# Altium project RD15002_SingleSCT.PrjPcb
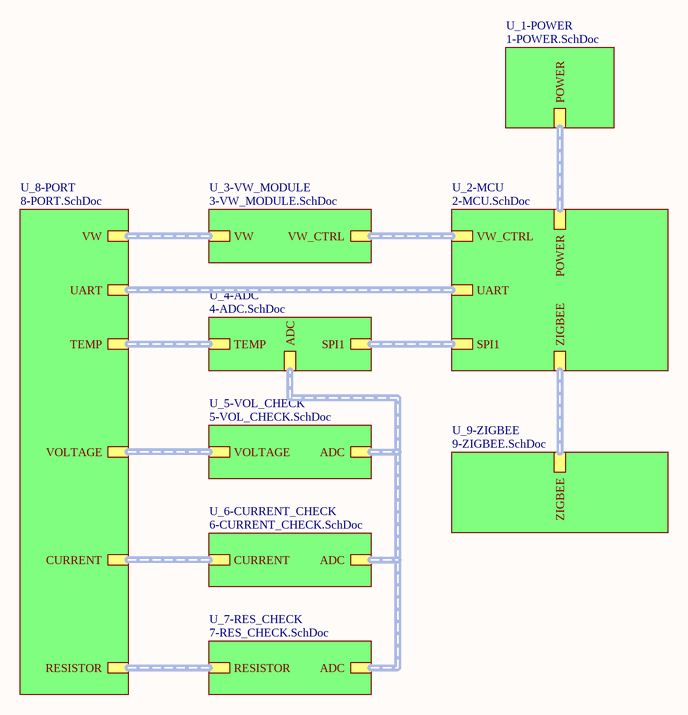
[diagram p0: RD15002_SingleSCT.SchDoc]
10 sheets, 207 parts. Net scope: hierarchical (ports join the sheet entries above them; power ports are global).
Board files: RD15002_SingleSCT.PcbDoc, RD15002_SingleSCT-20151223.PcbDoc
Sheets:
  RD15002_SingleSCT.SchDoc
    U_1-POWER = 1-POWER.SchDoc
    U_2-MCU = 2-MCU.SchDoc
    U_3-VW_MODULE = 3-VW_MODULE.SchDoc
    U_4-ADC = 4-ADC.SchDoc
    U_5-VOL_CHECK = 5-VOL_CHECK.SchDoc
    U_6-CURRENT_CHECK = 6-CURRENT_CHECK.SchDoc
    U_7-RES_CHECK = 7-RES_CHECK.SchDoc
    U_8-PORT = 8-PORT.SchDoc
    U_9-ZIGBEE = 9-ZIGBEE.SchDoc

## Sheet RD15002_SingleSCT.SchDoc: RD15002_SingleSCT.PrjPcb
size A4; DrawnBy: 邓勇杰; Revision: A1.0.0; SheetNumber: 1; SheetTotal: 10; Time: 2015/12/2

### Sub-sheets
U_1-POWER = 1-POWER.SchDoc: POWER (harness POWER)
U_2-MCU = 2-MCU.SchDoc: UART (harness UART), ZIGBEE (harness ZIGBEE), POWER (harness POWER), SPI1 (harness SPI1), VW_CTRL (harness VW_CTRL)
U_3-VW_MODULE = 3-VW_MODULE.SchDoc: VW_CTRL (harness VW_CTRL), VW (harness VW)
U_4-ADC = 4-ADC.SchDoc: SPI1 (harness SPI1), TEMP (harness TEMP), ADC (harness ADC)
U_5-VOL_CHECK = 5-VOL_CHECK.SchDoc: VOLTAGE (harness VOLTAGE), ADC (harness ADC)
U_6-CURRENT_CHECK = 6-CURRENT_CHECK.SchDoc: CURRENT (harness CURRENT), ADC (harness ADC)
U_7-RES_CHECK = 7-RES_CHECK.SchDoc: RESISTOR (harness RESISTOR), ADC (harness ADC)
U_8-PORT = 8-PORT.SchDoc: UART (harness UART), VW (harness VW), TEMP (harness TEMP), VOLTAGE (harness VOLTAGE), CURRENT (harness CURRENT), RESISTOR (harness RESISTOR)
U_9-ZIGBEE = 9-ZIGBEE.SchDoc: ZIGBEE (harness ZIGBEE)

### Buses and harness runs
harness sheet U_1-POWER/POWER = sheet U_2-MCU/POWER
harness sheet U_2-MCU/SPI1 = sheet U_4-ADC/SPI1
harness sheet U_2-MCU/UART = sheet U_8-PORT/UART
harness sheet U_2-MCU/VW_CTRL = sheet U_3-VW_MODULE/VW_CTRL
harness sheet U_2-MCU/ZIGBEE = sheet U_9-ZIGBEE/ZIGBEE
harness sheet U_3-VW_MODULE/VW = sheet U_8-PORT/VW
harness sheet U_4-ADC/ADC = sheet U_5-VOL_CHECK/ADC = sheet U_6-CURRENT_CHECK/ADC = sheet U_7-RES_CHECK/ADC
harness sheet U_4-ADC/TEMP = sheet U_8-PORT/TEMP
harness sheet U_5-VOL_CHECK/VOLTAGE = sheet U_8-PORT/VOLTAGE
harness sheet U_6-CURRENT_CHECK/CURRENT = sheet U_8-PORT/CURRENT
harness sheet U_7-RES_CHECK/RESISTOR = sheet U_8-PORT/RESISTOR

### Notes on the sheet
- 文件版本:
- 原理图名:
- 工 程  名:
- 绘       制:
- 审       核:
- 第   页，共    页
- 日       期:

## Sheet 1-POWER.SchDoc: RD15002_SingleSCT.PrjPcb
size A4; DrawnBy: 邓勇杰; Revision: A1.0.0; SheetNumber: 2; SheetTotal: 10; Time: 2015/12/2
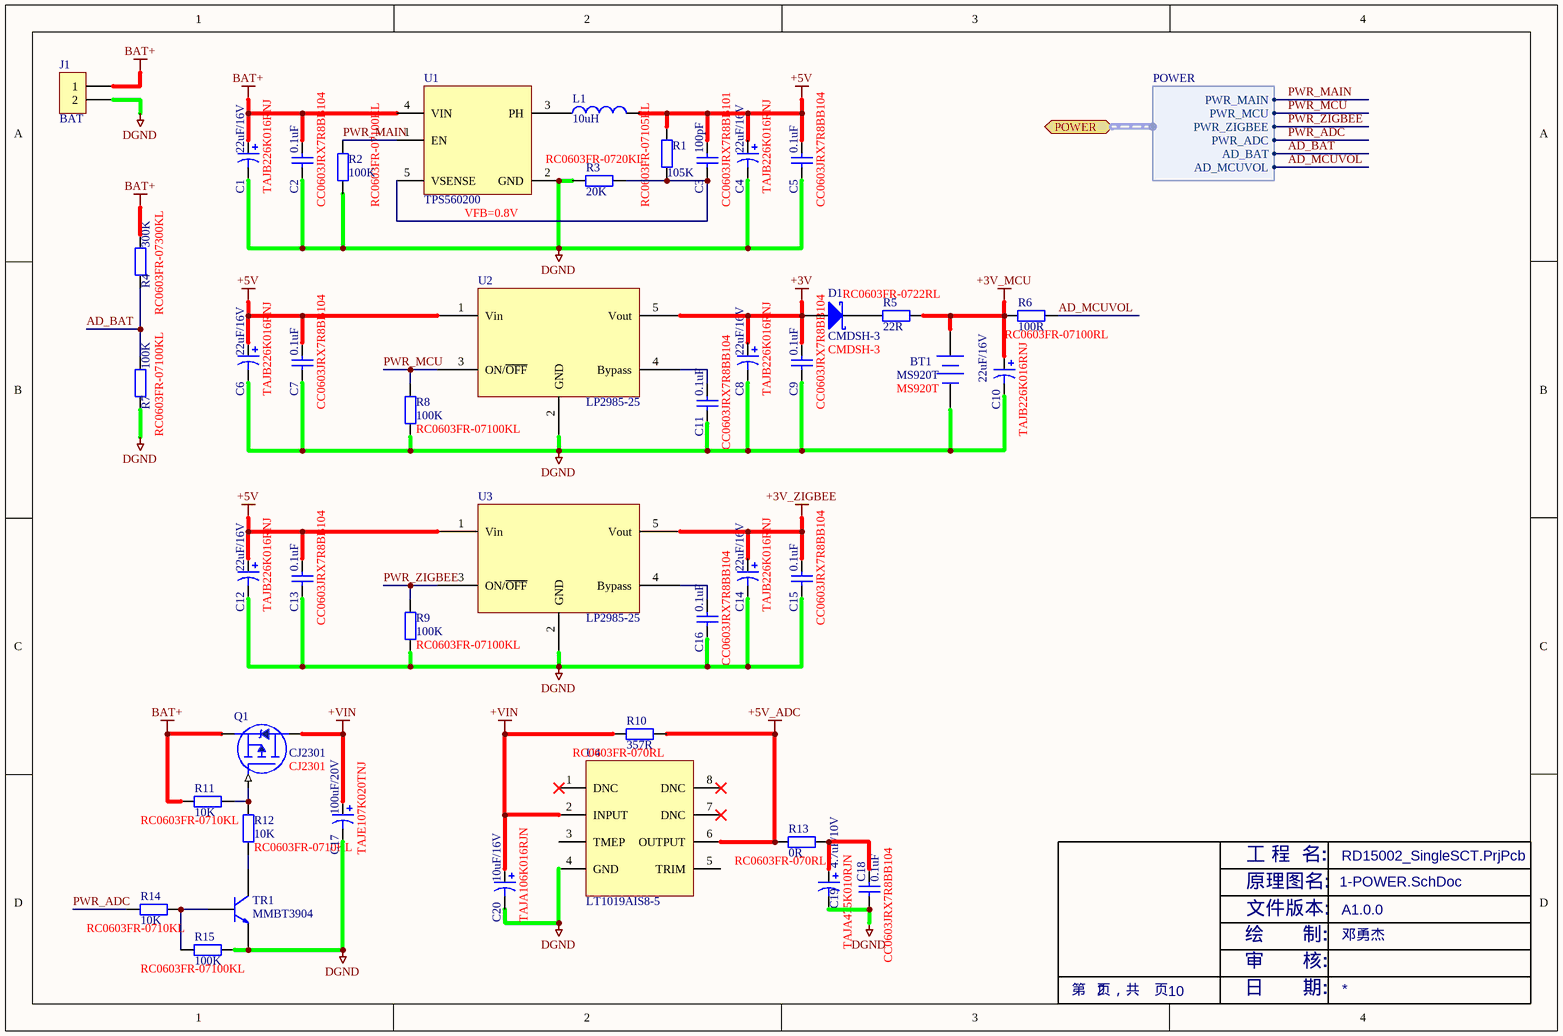
[diagram p1: 1-POWER.SchDoc]

### Parts
BT1  MS920T  [MS920T]
C1  22uF/16V  Part No.: TAJB226K016RNJ  [CB3528]
C2  0.1uF  Type No.: CC0603JRX7R8BB104  [CC0603]
C3  100pF  Type No.: CC0603JRX7R8BB101  [CC0603]
C4  22uF/16V  Part No.: TAJB226K016RNJ  [CB3528]
C5  0.1uF  Type No.: CC0603JRX7R8BB104  [CC0603]
C6  22uF/16V  Part No.: TAJB226K016RNJ  [CB3528]
C7  0.1uF  Type No.: CC0603JRX7R8BB104  [CC0603]
C8  22uF/16V  Part No.: TAJB226K016RNJ  [CB3528]
C9  0.1uF  Type No.: CC0603JRX7R8BB104  [CC0603]
C10  22uF/16V  Part No.: TAJB226K016RNJ  [CB3528]
C11  0.1uF  Type No.: CC0603JRX7R8BB104  [CC0603]
C12  22uF/16V  Part No.: TAJB226K016RNJ  [CB3528]
C13  0.1uF  Type No.: CC0603JRX7R8BB104  [CC0603]
C14  22uF/16V  Part No.: TAJB226K016RNJ  [CB3528]
C15  0.1uF  Type No.: CC0603JRX7R8BB104  [CC0603]
C16  0.1uF  Type No.: CC0603JRX7R8BB104  [CC0603]
C17  100uF/20V  Type No.: TAJE107K020TNJ  [CD7343]
C18  0.1uF  Type No.: CC0603JRX7R8BB104  [CC0603]
C19  4.7uF/10V  Type No.: TAJA475K010RJN  [CA3216]
C20  10uF/16V  Type No.: TAJA106K016RJN  [CA3216]
D1  CMDSH-3  [SOD323]
J1  BAT  [CON2-2.54MM]
L1  10uH  [SLF6025]
Q1  CJ2301  [SOT-23W]
R1  105K  Type No.: RC0603FR-07105KL  [CC0603]
R2  100K  Type No.: RC0603FR-07100KL  [CC0603]
R3  20K  Type No.: RC0603FR-0720KL  [CC0603]
R4  300K  Type No.: RC0603FR-07300KL  [CC0603]
R5  22R  Type No.: RC0603FR-0722RL  [CC0603]
R6  100R  Type No.: RC0603FR-07100RL  [CC0603]
R7  100K  Type No.: RC0603FR-07100KL  [CC0603]
R8  100K  Type No.: RC0603FR-07100KL  [CC0603]
R9  100K  Type No.: RC0603FR-07100KL  [CC0603]
R10  357R  Type No.: RC0603FR-070RL  [CC0603]
R11  10K  Type No.: RC0603FR-0710KL  [CC0603]
R12  10K  Type No.: RC0603FR-0710KL  [CC0603]
R13  0R  Type No.: RC0603FR-070RL  [CC0603]
R14  10K  Type No.: RC0603FR-0710KL  [CC0603]
R15  100K  Type No.: RC0603FR-07100KL  [CC0603]
TR1  MMBT3904  [SOT-23W]
U1  TPS560200  [SOT-23-5]
U2  LP2985-25  [SOT-23-5]
U3  LP2985-25  [SOT-23-5]
U4  LT1019AIS8-5  [SO-8]

### Ports
POWER (harness POWER)

### Harnesses
POWER: AD_BAT, PWR_MAIN, PWR_MCU, PWR_ZIGBEE, PWR_ADC, AD_MCUVOL

### Nets
+3V: C8.1 C9.2 D1.1(A) U2.5(Vout)
+3V_MCU: BT1.1(+) C10.1 R5.1 R6.2
+3V_ZIGBEE: C14.1 C15.2 U3.5(Vout)
+5V: C3.2 C4.1 C5.2 C6.1 C7.2 C12.1 C13.2 L1.2 R1.1 U2.1(Vin) U3.1(Vin)
+5V_ADC: R10.1 R13.2 U4.6(OUTPUT)
+VIN: C17.1 C20.1 Q1.3(DRAIN) R10.2 U4.2(INPUT)
BAT+: C1.1 C2.2 J1.1 Q1.2(SOURCE) R4.1 R11.2 U1.4(VIN)
DGND: BT1.2(-) C1.2 C2.1 C4.2 C5.1 C6.2 C7.1 C8.2 C9.1 C10.2 C11.1 C12.2 C13.1 C14.2 C15.1 C16.1 C17.2 C18.1 C19.2 C20.2 J1.2 R2.2 R3.2 R7.2 R8.2 R9.2 R15.1 TR1.2 U1.2(GND) U2.2(GND) U3.2(GND) U4.4(GND)
AD_BAT: R4.2 R7.1 ; port POWER.AD_BAT
AD_MCUVOL: R6.1 ; port POWER.AD_MCUVOL
PWR_ADC: R14.2 ; port POWER.PWR_ADC
PWR_MAIN: R2.1 U1.1(EN) ; port POWER.PWR_MAIN
PWR_MCU: R8.1 U2.3(ON/~{OFF}) ; port POWER.PWR_MCU
PWR_ZIGBEE: R9.1 U3.3(ON/~{OFF}) ; port POWER.PWR_ZIGBEE
NetC3_1: C3.1 R1.2 R3.1 U1.5(VSENSE)
NetC11_2: C11.2 U2.4(Bypass)
NetC16_2: C16.2 U3.4(Bypass)
NetC18_2: C18.2 C19.1 R13.1
NetD1_2: D1.2(K) R5.2
NetL1_1: L1.1 U1.3(PH)
NetQ1_1: Q1.1(GATE) R11.1 R12.1
NetR12_2: R12.2 TR1.3
NetR14_1: R14.1 R15.2 TR1.1

Not connected (* = marked no-connect by the designer): U4 1(DNC)* 3(TMEP) 5(TRIM) 7(DNC)* 8(DNC)*

### Notes on the sheet
- (near U1) VFB=0.8V
- 文件版本:
- 原理图名:
- 工 程  名:
- 绘       制:
- 审       核:
- 第   页，共    页
- 日       期:

### Library data of the parts
BT1 = Battery: Multicell Battery; Type No.: MS920T
C1 C4 C6 C8 C10 C12 C14 C19 C20 = Cap Pol1: Polarized Capacitor (Radial)
C2 C3 C5 C7 C9 C11 C13 C15 C16 C18 = Cap: Capacitor
C17 = Cap Pol3: Polarized Capacitor (Surface Mount)
D1 = D Schottky: Schottky Diode; Type No.: CMDSH-3
J1 = SIP2: jointbar
L1 = Inductor: Code_IEC: 1005; Value: 10mH; Published: 8-Jun-2000; LatestRevisionDate: 29-May-2009; LatestRevisionNote: IPC-7351 Footprint Added.; PackageReference: 0402-A; Publisher: Altium Limited; PackageDescription: Chip Inductor; Code_JEITA: 0402
Q1 = P-MOSFET1: Type No.: CJ2301
R1-R15 = Res2: Resistor
TR1 = NPN
U2 U3 = LP2985

## Sheet 2-MCU.SchDoc: RD15002_SingleSCT.PrjPcb
size A4; DrawnBy: 邓勇杰; Revision: A1.0.0; SheetNumber: 3; SheetTotal: 10; Time: 2015/12/2
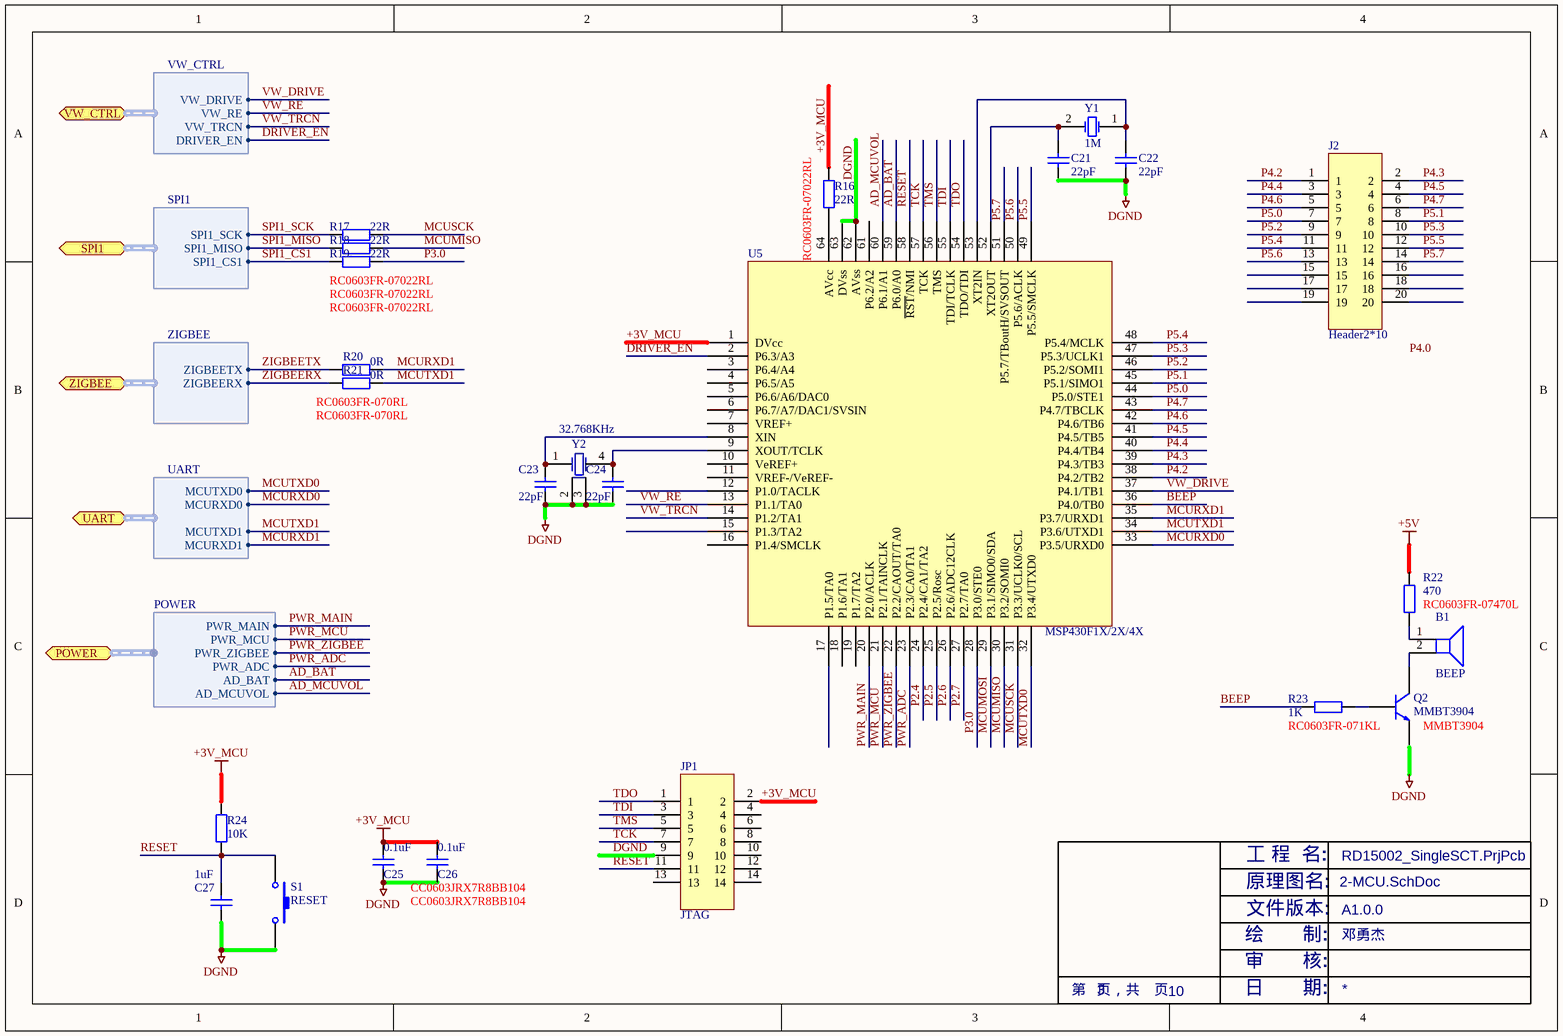
[diagram p2: 2-MCU.SchDoc]

### Parts
B1  BEEP  [BUZZER-5V]
C21  22pF  [CC0603]
C22  22pF  [CC0603]
C23  22pF  [CC0603]
C24  22pF  [CC0603]
C25  0.1uF  Type No.: CC0603JRX7R8BB104  [CC0603]
C26  0.1uF  Type No.: CC0603JRX7R8BB104  [CC0603]
C27  1uF  [CC0603]
J2  Header2*10  [IDC20-2.0MM]
JP1  JTAG  [IDC14-2.0MM]
Q2  MMBT3904  [SOT-23W]
R16  22R  Type No.: RC0603FR-07022RL  [CC0603]
R17  22R  Type No.: RC0603FR-07022RL  [CC0603]
R18  22R  Type No.: RC0603FR-07022RL  [CC0603]
R19  22R  Type No.: RC0603FR-07022RL  [CC0603]
R20  0R  Type No.: RC0603FR-070RL  [CC0603]
R21  0R  Type No.: RC0603FR-070RL  [CC0603]
R22  470  Type No.: RC0603FR-07470L  [CC0603]
R23  1K  Type No.: RC0603FR-071KL  [CC0603]
R24  10K  [CC0603]
S1  RESET  [SPST]
U5  MSP430F1X/2X/4X  [LQFP64]
Y1  1M  [XCYAI]
Y2  32.768KHz  [MC-146]

### Ports
POWER (harness POWER), SPI1 (harness SPI1), UART (harness UART), VW_CTRL (harness VW_CTRL), ZIGBEE (harness ZIGBEE)

### Harnesses
UART: MCUTXD0, MCUTXD1, MCURXD0, MCURXD1
ZIGBEE: ZIGBEETX, ZIGBEERX
POWER: AD_BAT, PWR_MAIN, PWR_MCU, PWR_ZIGBEE, PWR_ADC, AD_MCUVOL
SPI1: SPI1_SCK, SPI1_MISO, SPI1_CS1
VW_CTRL: VW_RE, VW_DRIVE, VW_TRCN, DRIVER_EN

### Nets
+3V_MCU: C25.2 C26.2 JP1.2 R16.2 R24.2 U5.1(DVcc)
+5V: R22.2
DGND: C21.1 C22.1 C23.2 C24.2 C25.1 C26.1 C27.1 JP1.9 Q2.2 S1.1 U5.62(AVss) U5.63(DVss) Y2.2(GND) Y2.3(GND)
AD_BAT: U5.59(P6.0/A0) ; port POWER.AD_BAT
AD_MCUVOL: U5.60(P6.1/A1) ; port POWER.AD_MCUVOL
BEEP: R23.2 U5.36(P4.0/TB0)
DRIVER_EN: U5.2(P6.3/A3) ; port VW_CTRL.DRIVER_EN
MCUMISO: R18.1 U5.30(P3.2/SOMI0)
MCUMOSI: U5.29(P3.1/SIMO0/SDA)
MCURXD0: U5.33(P3.5/URXD0) ; port UART.MCURXD0
MCURXD1: R20.1 U5.35(P3.7/URXD1) ; port UART.MCURXD1
MCUSCK: R17.1 U5.31(P3.3/UCLK0/SCL)
MCUTXD0: U5.32(P3.4/UTXD0) ; port UART.MCUTXD0
MCUTXD1: R21.1 U5.34(P3.6/UTXD1) ; port UART.MCUTXD1
P2.4: U5.24(P2.4/CA1/TA2)
P2.5: U5.25(P2.5/Rosc)
P2.6: U5.26(P2.6/ADC12CLK)
P2.7: U5.27(P2.7/TA0)
P3.0: R19.1 U5.28(P3.0/STE0)
P4.2: J2.1 U5.38(P4.2/TB2)
P4.3: J2.2 U5.39(P4.3/TB3)
P4.4: J2.3 U5.40(P4.4/TB4)
P4.5: J2.4 U5.41(P4.5/TB5)
P4.6: J2.5 U5.42(P4.6/TB6)
P4.7: J2.6 U5.43(P4.7/TBCLK)
P5.0: J2.7 U5.44(P5.0/STE1)
P5.1: J2.8 U5.45(P5.1/SIMO1)
P5.2: J2.9 U5.46(P5.2/SOMI1)
P5.3: J2.10 U5.47(P5.3/UCLK1)
P5.4: J2.11 U5.48(P5.4/MCLK)
P5.5: J2.12 U5.49(P5.5/SMCLK)
P5.6: J2.13 U5.50(P5.6/ACLK)
P5.7: J2.14 U5.51(P5.7/TBoutH/SVSOUT)
PWR_ADC: U5.23(P2.3/CA0/TA1) ; port POWER.PWR_ADC
PWR_MAIN: U5.20(P2.0/ACLK) ; port POWER.PWR_MAIN
PWR_MCU: U5.21(P2.1/TAINCLK) ; port POWER.PWR_MCU
PWR_ZIGBEE: U5.22(P2.2/CAOUT/TA0) ; port POWER.PWR_ZIGBEE
RESET: C27.2 JP1.11 R24.1 S1.2 U5.58(~{RST}/NMI)
SPI1_CS1: R19.2 ; port SPI1.SPI1_CS1
SPI1_MISO: R18.2 ; port SPI1.SPI1_MISO
SPI1_SCK: R17.2 ; port SPI1.SPI1_SCK
TCK: JP1.7 U5.57(TCK)
TDI: JP1.3 U5.55(TDI/TCLK)
TDO: JP1.1 U5.54(TDO/TDI)
TMS: JP1.5 U5.56(TMS)
VW_DRIVE: U5.37(P4.1/TB1) ; port VW_CTRL.VW_DRIVE
VW_RE: U5.13(P1.1/TA0) ; port VW_CTRL.VW_RE
VW_TRCN: U5.14(P1.2/TA1) ; port VW_CTRL.VW_TRCN
ZIGBEERX: R21.2 ; port ZIGBEE.ZIGBEERX
ZIGBEETX: R20.2 ; port ZIGBEE.ZIGBEETX
NetB1_1: B1.1 R22.1
NetB1_2: B1.2 Q2.3
NetC21_2: C21.2 U5.52(XT2OUT) Y1.2(OSC2)
NetC22_2: C22.2 U5.53(XT2IN) Y1.1(OSC1)
NetC23_1: C23.1 U5.8(XIN) Y2.1(X1)
NetC24_1: C24.1 U5.9(XOUT/TCLK) Y2.4(X2)
NetQ2_1: Q2.1 R23.1
NetR16_1: R16.1 U5.64(AVcc)

Not connected (* = marked no-connect by the designer): J2 15 16 17 18 19 20; JP1 4 6 8 10 12 13 14; U5 3(P6.4/A4) 4(P6.5/A5) 5(P6.6/A6/DAC0) 6(P6.7/A7/DAC1/SVSIN) 7(VREF+) 10(VeREF+) 11(VREF-/VeREF-) 12(P1.0/TACLK) 15(P1.3/TA2) 16(P1.4/SMCLK) 17(P1.5/TA0) 18(P1.6/TA1) 19(P1.7/TA2) 61(P6.2/A2)

### Notes on the sheet
- Labels drawn without touching a wire or pin: P4.0
- 文件版本:
- 原理图名:
- 工 程  名:
- 绘       制:
- 审       核:
- 第   页，共    页
- 日       期:

### Library data of the parts
C21-C24 C27 = Cap: Capacitor; Value: 100pF; Published: 8-Jun-2000; LatestRevisionDate: 17-Jul-2002; LatestRevisionNote: Re-released for DXP Platform.; PackageReference: RAD-0.3; Publisher: Altium Limited
C25 C26 = Cap: Capacitor
JP1 = Header2*7
Q2 = NPN: Type No.: MMBT3904
R16-R23 = Res2: Resistor
R24 = Res2: Resistor; Value: 1K; Published: 8-Jun-2000; LatestRevisionDate: 17-Jul-2002; LatestRevisionNote: Re-released for DXP Platform.; PackageReference: AXIAL-0.4; Publisher: Altium Limited
S1 = SW-PB: Switch; Published: 24-Mar-1999; LatestRevisionDate: 17-Jul-2002; LatestRevisionNote: Re-released for DXP Platform.; PackageReference: SPST-2; Publisher: Altium Limited
Y1 = XTAL: Crystal Oscillator; Published: 8-Jun-2000; LatestRevisionDate: 17-Jul-2002; LatestRevisionNote: Re-released for DXP Platform.; PackageReference: R38; Publisher: Altium Limited
Y2 = MC-146
B1 = BEEP: Dimension: 9*5.5mm 3.3V

## Sheet 3-VW_MODULE.SchDoc: RD15002_SingleSCT.PrjPcb
size A4; DrawnBy: 邓勇杰; Revision: A1.0.0; SheetNumber: 4; SheetTotal: 10; Time: 2015/12/2
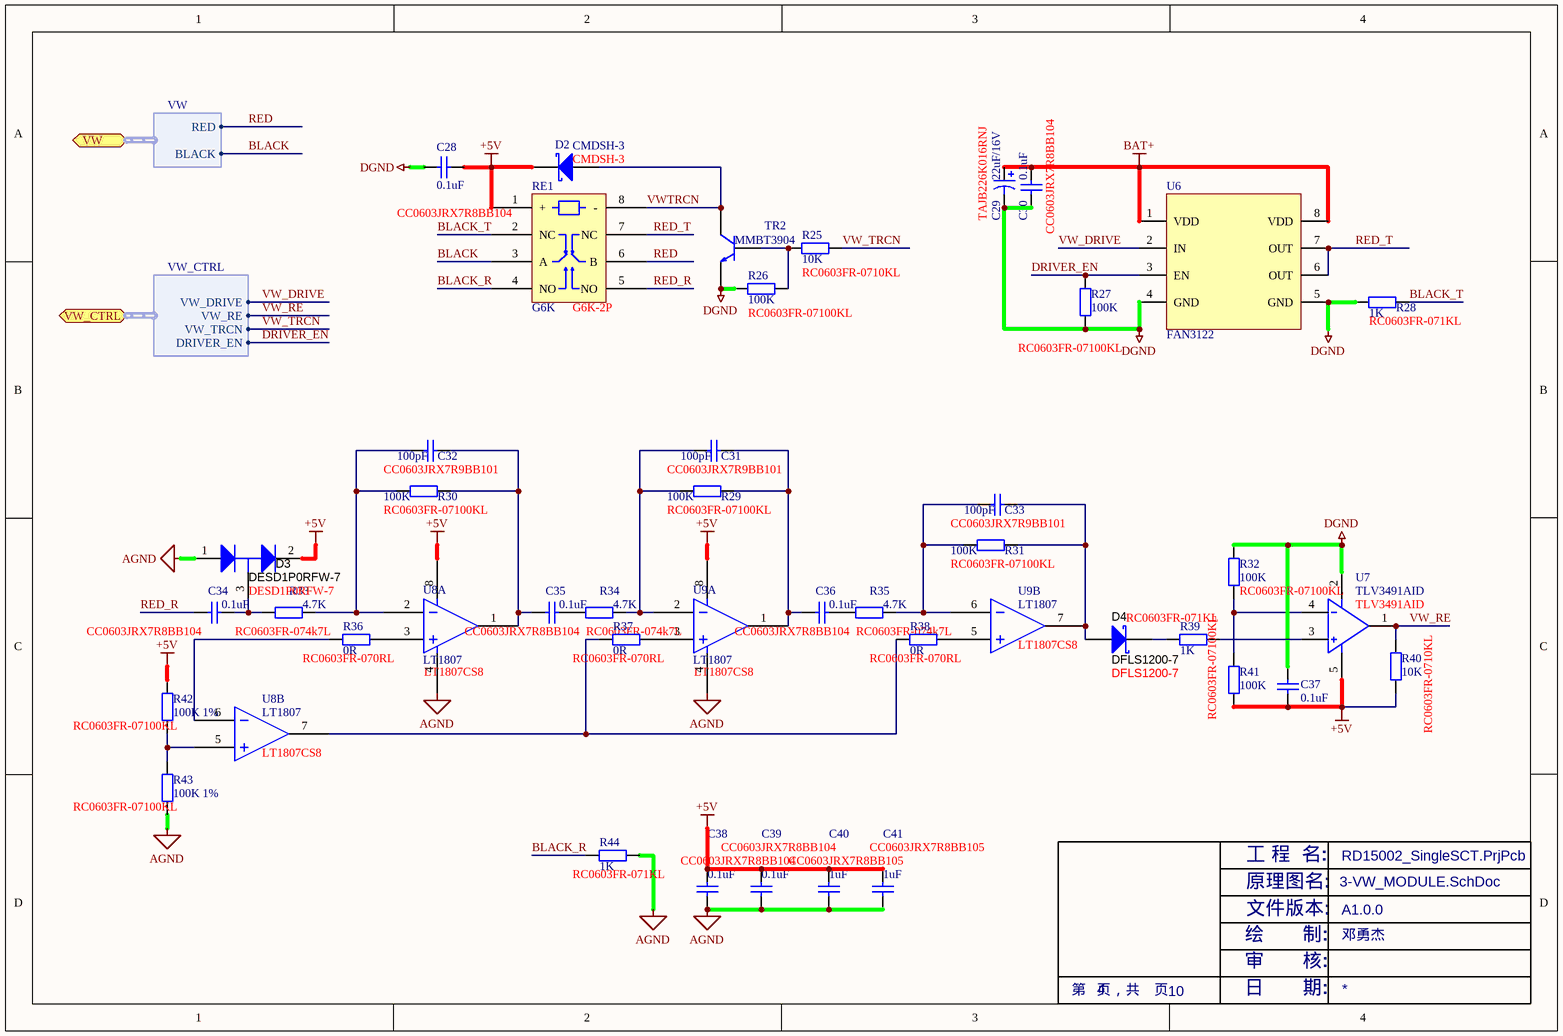
[diagram p3: 3-VW_MODULE.SchDoc]

### Parts
C28  0.1uF  Type No.: CC0603JRX7R8BB104  [CC0603]
C29  22uF/16V  Part No.: TAJB226K016RNJ  [CB3528]
C30  0.1uF  Type No.: CC0603JRX7R8BB104  [CC0603]
C31  100pF  Type No.: CC0603JRX7R9BB101  [CC0603]
C32  100pF  Type No.: CC0603JRX7R9BB101  [CC0603]
C33  100pF  Type No.: CC0603JRX7R9BB101  [CC0603]
C34  0.1uF  Type No.: CC0603JRX7R8BB104  [CC0603]
C35  0.1uF  Type No.: CC0603JRX7R8BB104  [CC0603]
C36  0.1uF  Type No.: CC0603JRX7R8BB104  [CC0603]
C37  0.1uF  [CC0603]
C38  0.1uF  Type No.: CC0603JRX7R8BB104  [CC0603]
C39  0.1uF  Type No.: CC0603JRX7R8BB104  [CC0603]
C40  1uF  Type No.: CC0603JRX7R8BB105  [CC0603]
C41  1uF  Type No.: CC0603JRX7R8BB105  [CC0603]
D2  CMDSH-3  [SOD323]
D3  DESD1P0RFW-7  [SOT-323]
D4  DFLS1200-7  [powerDI123]
R25  10K  Type No.: RC0603FR-0710KL  [CC0603]
R26  100K  Type No.: RC0603FR-07100KL  [CC0603]
R27  100K  Type No.: RC0603FR-07100KL  [CC0603]
R28  1K  Type No.: RC0603FR-071KL  [CC0603]
R29  100K  Type No.: RC0603FR-07100KL  [CC0603]
R30  100K  Type No.: RC0603FR-07100KL  [CC0603]
R31  100K  Type No.: RC0603FR-07100KL  [CC0603]
R32  100K  Type No.: RC0603FR-07100KL  [CC0603]
R33  4.7K  Type No.: RC0603FR-074k7L  [CC0603]
R34  4.7K  Type No.: RC0603FR-074k7L  [CC0603]
R35  4.7K  Type No.: RC0603FR-074k7L  [CC0603]
R36  0R  Type No.: RC0603FR-070RL  [CC0603]
R37  0R  Type No.: RC0603FR-070RL  [CC0603]
R38  0R  Type No.: RC0603FR-070RL  [CC0603]
R39  1K  Type No.: RC0603FR-071KL  [CC0603]
R40  10K  Type No.: RC0603FR-0710KL  [CC0603]
R41  100K  Type No.: RC0603FR-07100KL  [CC0603]
R42  100K 1%  Type No.: RC0603FR-07100KL  [CC0603]
R43  100K 1%  Type No.: RC0603FR-07100KL  [CC0603]
R44  1K  Type No.: RC0603FR-071KL  [CC0603]
RE1  G6K  Type No.: G6K-2P  [G6K]
TR2  MMBT3904  [SOT-23W]
U6  FAN3122  [SO-8]
U7  TLV3491AID  [SOT-23-5]
U8  LT1807  Type No.: LT1807CS8  [SO-8]  (parts A,B of 2)
U9  LT1807  Type No.: LT1807CS8  [SO-8]  (parts A,B of 2)

### Ports
VW (harness VW), VW_CTRL (harness VW_CTRL)

### Harnesses
VW_CTRL: VW_RE, VW_DRIVE, VW_TRCN, DRIVER_EN
VW: RED, BLACK

### Nets
+5V: C28.1 C37.2 C38.2 C39.2 C40.2 C41.2 D2.2(K) D3.2(K) R40.1 R41.1 R42.1 RE1.1(+) U7.5(+VS) U8.8 U9.8
AGND: C38.1 C39.1 C40.1 C41.1 D3.1(A) R43.2 R44.2 U8.4 U9.4
BAT+: C29.1 C30.2 U6.1(VDD) U6.8(VDD)
DGND: C28.2 C29.2 C30.1 C37.1 R26.1 R27.2 R28.2 R32.2 TR2.2 U6.4(GND) U6.5(GND) U7.2(-VS)
BLACK: RE1.3(A) ; port VW.BLACK
BLACK_R: R44.1 RE1.4(NO)
BLACK_T: R28.1 RE1.2(NC)
DRIVER_EN: R27.1 U6.3(EN) ; port VW_CTRL.DRIVER_EN
RED: RE1.6(B) ; port VW.RED
RED_R: C34.2 RE1.5(NO)
RED_T: RE1.7(NC) U6.6(OUT) U6.7(OUT)
VW_DRIVE: U6.2(IN) ; port VW_CTRL.VW_DRIVE
VW_RE: R40.2 U7.1(OUT) ; port VW_CTRL.VW_RE
VW_TRCN: R25.2 ; port VW_CTRL.VW_TRCN
VWTRCN: D2.1(A) RE1.8(-) TR2.3
NetC31_1: C31.1 C36.2 R29.1 U9.1
NetC31_2: C31.2 R29.2 R34.1 U9.2
NetC32_1: C32.1 C35.2 R30.1 U8.1
NetC32_2: C32.2 R30.2 R33.1 U8.2
NetC33_1: C33.1 D4.2(A) R31.1 U9.7
NetC33_2: C33.2 R31.2 R35.1 U9.6
NetC34_1: C34.1 D3.3(C) R33.2
NetC35_1: C35.1 R34.2
NetC36_1: C36.1 R35.2
NetD4_1: D4.1(K) R39.2
NetR25_1: R25.1 R26.2 TR2.1
NetR32_1: R32.1 R41.2 U7.4(-)
NetR36_1: R36.1 U8.3
NetR36_2: R36.2 U8.6
NetR37_1: R37.1 U9.3
NetR37_2: R37.2 R38.2 U8.7
NetR38_1: R38.1 U9.5
NetR39_1: R39.1 U7.3(+)
NetR42_2: R42.2 R43.1 U8.5

### Notes on the sheet
- 文件版本:
- 原理图名:
- 工 程  名:
- 绘       制:
- 审       核:
- 第   页，共    页
- 日       期:

### Library data of the parts
C28 C30-C41 = Cap: Capacitor
  C37: Published: 8-Jun-2000; LatestRevisionDate: 17-Jul-2002; LatestRevisionNote: Re-released for DXP Platform.; PackageReference: RAD-0.3; Publisher: Altium Limited; Value: 0.1uF
C29 = Cap Pol1: Polarized Capacitor (Radial)
D2 = D Schottky: Schottky Diode; Type No.: CMDSH-3
D3 = BAV99WT1G: TVS DIODE,70VVVM,8VC,SOT-323; Type No.: DESD1P0RFW-7
D4 = DFLS1200-7: Diode, Schotky, 200V, 1A, PowerDI123; Part No.: DFLS1200-7
R25-R44 = Res2: Resistor
TR2 = NPN
U8 U9 = LM833N
U7 = TLV3491AID: Type No.: TLV3491AID

## Sheet 4-ADC.SchDoc: RD15002_SingleSCT.PrjPcb
size A4; DrawnBy: 邓勇杰; Revision: A1.0.0; SheetNumber: 5; SheetTotal: 10; Time: 2015/12/2
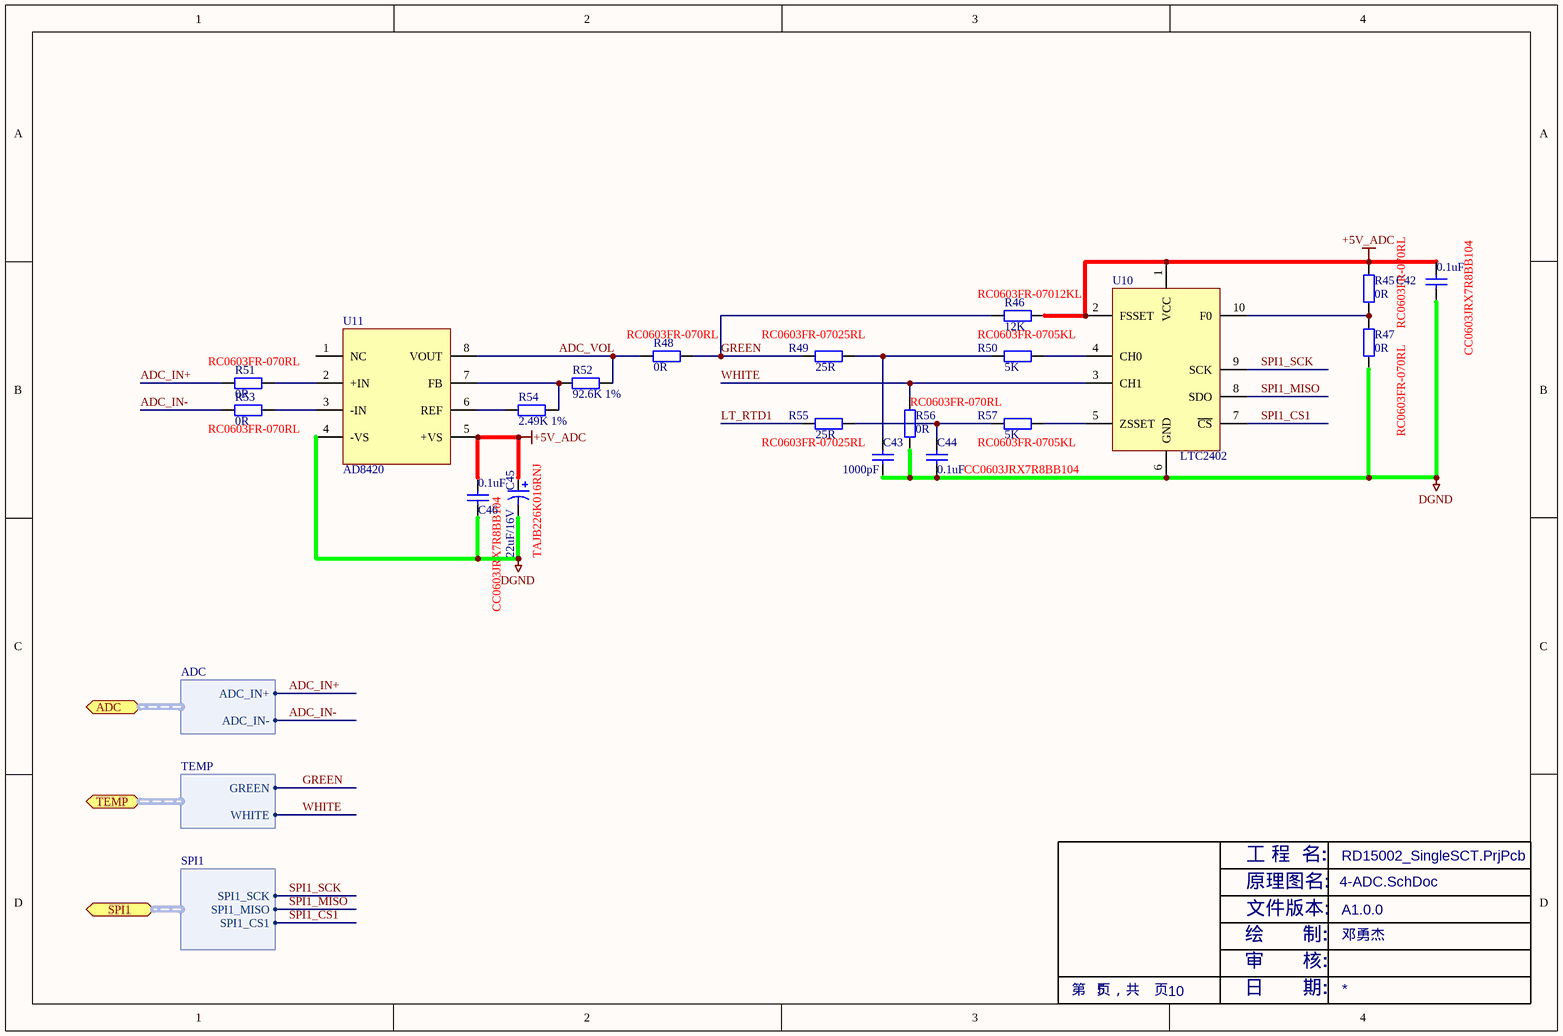
[diagram p4: 4-ADC.SchDoc]

### Parts
C42  0.1uF  Type No.: CC0603JRX7R8BB104  [CC0603]
C43  1000pF  [CC0603]
C44  0.1uF  Type No.: CC0603JRX7R8BB104  [CC0603]
C45  22uF/16V  Part No.: TAJB226K016RNJ  [CB3528]
C46  0.1uF  Type No.: CC0603JRX7R8BB104  [CC0603]
R45  0R  Type No.: RC0603FR-070RL  [CC0603]
R46  12K  Type No.: RC0603FR-07012KL  [CC0603]
R47  0R  Type No.: RC0603FR-070RL  [CC0603]
R48  0R  Type No.: RC0603FR-070RL  [CC0603]
R49  25R  Type No.: RC0603FR-07025RL  [CC0603]
R50  5K  Type No.: RC0603FR-0705KL  [CC0603]
R51  0R  Type No.: RC0603FR-070RL  [CC0603]
R52  92.6K 1%  [CC0603]
R53  0R  Type No.: RC0603FR-070RL  [CC0603]
R54  2.49K 1%  [CC0603]
R55  25R  Type No.: RC0603FR-07025RL  [CC0603]
R56  0R  Type No.: RC0603FR-070RL  [CC0603]
R57  5K  Type No.: RC0603FR-0705KL  [CC0603]
U10  LTC2402  [MS10]
U11  AD8420  [MSOP8]

### Ports
ADC (harness ADC), SPI1 (harness SPI1), TEMP (harness TEMP)

### Harnesses
SPI1: SPI1_SCK, SPI1_MISO, SPI1_CS1
TEMP: GREEN, WHITE
ADC: ADC_IN+, ADC_IN-

### Nets
+5V_ADC: C42.2 C45.1 C46.2 R45.1 R46.1 U10.1(VCC) U10.2(FSSET) U11.5(+VS)
DGND: C42.1 C43.1 C44.1 C45.2 C46.1 R47.2 R56.1 U10.6(GND) U11.4(-VS)
ADC_IN+: R51.1 ; port ADC.ADC_IN+
ADC_IN-: R53.1 ; port ADC.ADC_IN-
ADC_VOL: R48.1 R52.2 U11.8(VOUT)
GREEN: R46.2 R48.2 R49.1 ; port TEMP.GREEN
LT_RTD1: R55.1
SPI1_CS1: U10.7(~{CS}) ; port SPI1.SPI1_CS1
SPI1_MISO: U10.8(SDO) ; port SPI1.SPI1_MISO
SPI1_SCK: U10.9(SCK) ; port SPI1.SPI1_SCK
WHITE: R56.2 U10.3(CH1) ; port TEMP.WHITE
NetC43_2: C43.2 R49.2 R50.1
NetC44_2: C44.2 R55.2 R57.1
NetR45_2: R45.2 R47.1 U10.10(F0)
NetR50_2: R50.2 U10.4(CH0)
NetR51_2: R51.2 U11.2(+IN)
NetR52_1: R52.1 R54.2 U11.7(FB)
NetR53_2: R53.2 U11.3(-IN)
NetR54_1: R54.1 U11.6(REF)
NetR57_2: R57.2 U10.5(ZSSET)

Not connected (* = marked no-connect by the designer): U11 1(NC)

### Notes on the sheet
- 文件版本:
- 原理图名:
- 工 程  名:
- 绘       制:
- 审       核:
- 第   页，共    页
- 日       期:

### Library data of the parts
C42-C44 C46 = Cap: Capacitor
C45 = Cap Pol1: Polarized Capacitor (Radial)
R45-R51 R53 R55-R57 = Res2: Resistor
R52 R54 = Res2: Resistor; Value: 1K; Published: 8-Jun-2000; LatestRevisionDate: 17-Jul-2002; LatestRevisionNote: Re-released for DXP Platform.; PackageReference: AXIAL-0.4; Publisher: Altium Limited

## Sheet 5-VOL_CHECK.SchDoc: RD15002_SingleSCT.PrjPcb
size A4; DrawnBy: 邓勇杰; Revision: A1.0.0; SheetNumber: 6; SheetTotal: 10; Time: 2015/12/2
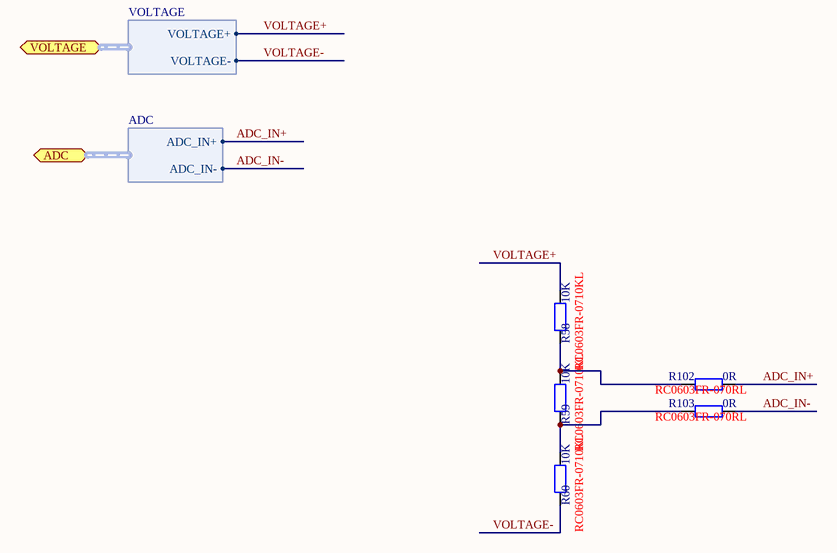
[diagram p5: 5-VOL_CHECK.SchDoc]

### Parts
R58  10K  Type No.: RC0603FR-0710KL  [CC0603]
R59  10K  Type No.: RC0603FR-0710KL  [CC0603]
R60  10K  Type No.: RC0603FR-0710KL  [CC0603]
R102  0R  Type No.: RC0603FR-070RL  [CC0603]
R103  0R  Type No.: RC0603FR-070RL  [CC0603]

### Ports
ADC (harness ADC), VOLTAGE (harness VOLTAGE)

### Harnesses
VOLTAGE: VOLTAGE+, VOLTAGE-
ADC: ADC_IN+, ADC_IN-

### Nets
ADC_IN+: R102.1 ; port ADC.ADC_IN+
ADC_IN-: R103.1 ; port ADC.ADC_IN-
VOLTAGE+: R58.1 ; port VOLTAGE.VOLTAGE+
VOLTAGE-: R60.2 ; port VOLTAGE.VOLTAGE-
NetR58_2: R58.2 R59.1 R102.2
NetR59_2: R59.2 R60.1 R103.2

### Notes on the sheet
- 文件版本:
- 原理图名:
- 工 程  名:
- 绘       制:
- 审       核:
- 第   页，共    页
- 日       期:

### Library data of the parts
R58-R60 R102 R103 = Res2: Resistor

## Sheet 6-CURRENT_CHECK.SchDoc: RD15002_SingleSCT.PrjPcb
size A4; DrawnBy: 邓勇杰; Revision: A1.0.0; SheetNumber: 7; SheetTotal: 10; Time: 2015/12/2
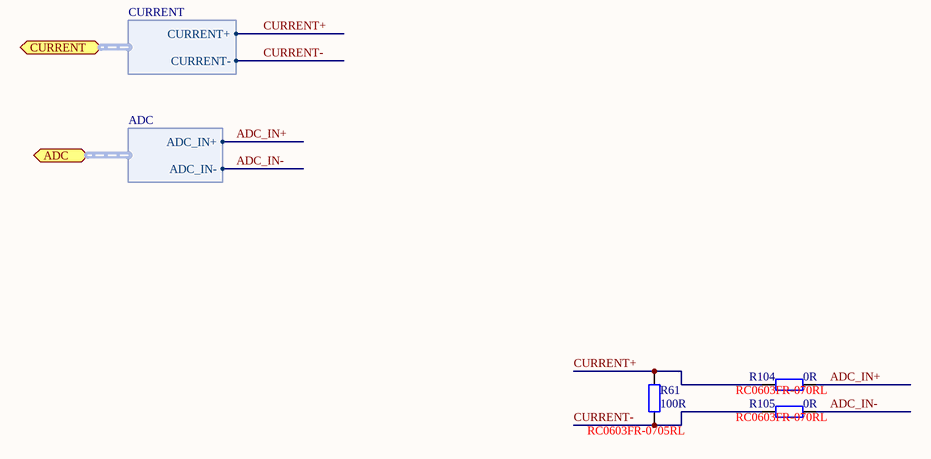
[diagram p6: 6-CURRENT_CHECK.SchDoc]

### Parts
R61  100R  Type No.: RC0603FR-0705RL  [CC0603]
R104  0R  Type No.: RC0603FR-070RL  [CC0603]
R105  0R  Type No.: RC0603FR-070RL  [CC0603]

### Ports
ADC (harness ADC), CURRENT (harness CURRENT)

### Harnesses
CURRENT: CURRENT+, CURRENT-
ADC: ADC_IN+, ADC_IN-

### Nets
ADC_IN+: R104.1 ; port ADC.ADC_IN+
ADC_IN-: R105.1 ; port ADC.ADC_IN-
CURRENT+: R61.1 R104.2 ; port CURRENT.CURRENT+
CURRENT-: R61.2 R105.2 ; port CURRENT.CURRENT-

### Notes on the sheet
- 文件版本:
- 原理图名:
- 工 程  名:
- 绘       制:
- 审       核:
- 第   页，共    页
- 日       期:

### Library data of the parts
R61 R104 R105 = Res2: Resistor

## Sheet 7-RES_CHECK.SchDoc: RD15002_SingleSCT.PrjPcb
size A4; DrawnBy: 邓勇杰; Revision: A1.0.0; SheetNumber: 8; SheetTotal: 10; Time: 2015/12/2
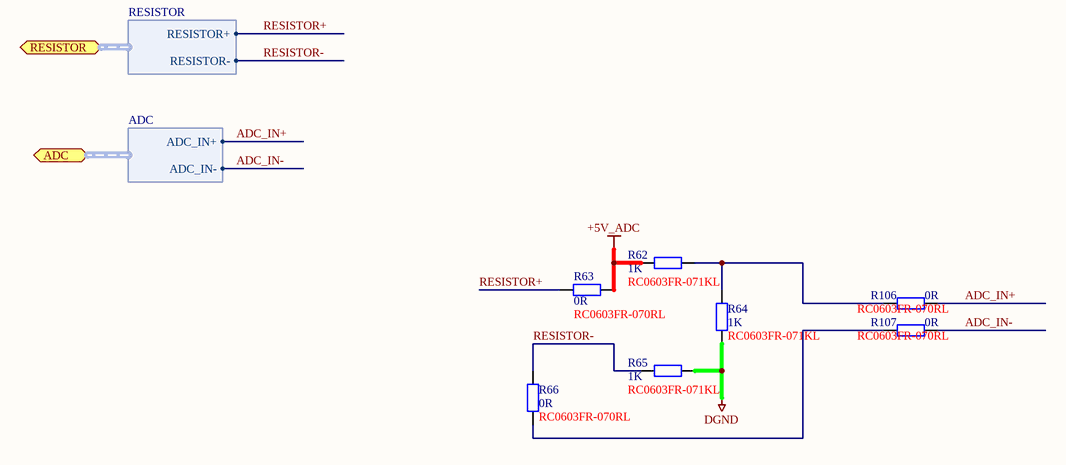
[diagram p7: 7-RES_CHECK.SchDoc]

### Parts
R62  1K  Type No.: RC0603FR-071KL  [CC0603]
R63  0R  Type No.: RC0603FR-070RL  [CC0603]
R64  1K  Type No.: RC0603FR-071KL  [CC0603]
R65  1K  Type No.: RC0603FR-071KL  [CC0603]
R66  0R  Type No.: RC0603FR-070RL  [CC0603]
R106  0R  Type No.: RC0603FR-070RL  [CC0603]
R107  0R  Type No.: RC0603FR-070RL  [CC0603]

### Ports
ADC (harness ADC), RESISTOR (harness RESISTOR)

### Harnesses
RESISTOR: RESISTOR+, RESISTOR-
ADC: ADC_IN+, ADC_IN-

### Nets
+5V_ADC: R62.2 R63.2
DGND: R64.2 R65.1
ADC_IN+: R106.1 ; port ADC.ADC_IN+
ADC_IN-: R107.1 ; port ADC.ADC_IN-
RESISTOR+: R63.1 ; port RESISTOR.RESISTOR+
RESISTOR-: R65.2 R66.1 ; port RESISTOR.RESISTOR-
NetR62_1: R62.1 R64.1 R106.2
NetR66_2: R66.2 R107.2

### Notes on the sheet
- 文件版本:
- 原理图名:
- 工 程  名:
- 绘       制:
- 审       核:
- 第   页，共    页
- 日       期:

### Library data of the parts
R62-R66 R106 R107 = Res2: Resistor

## Sheet 8-PORT.SchDoc: RD15002_SingleSCT.PrjPcb
size A4; DrawnBy: 邓勇杰; Revision: A1.0.0; SheetNumber: 9; SheetTotal: 10; Time: 2015/12/2
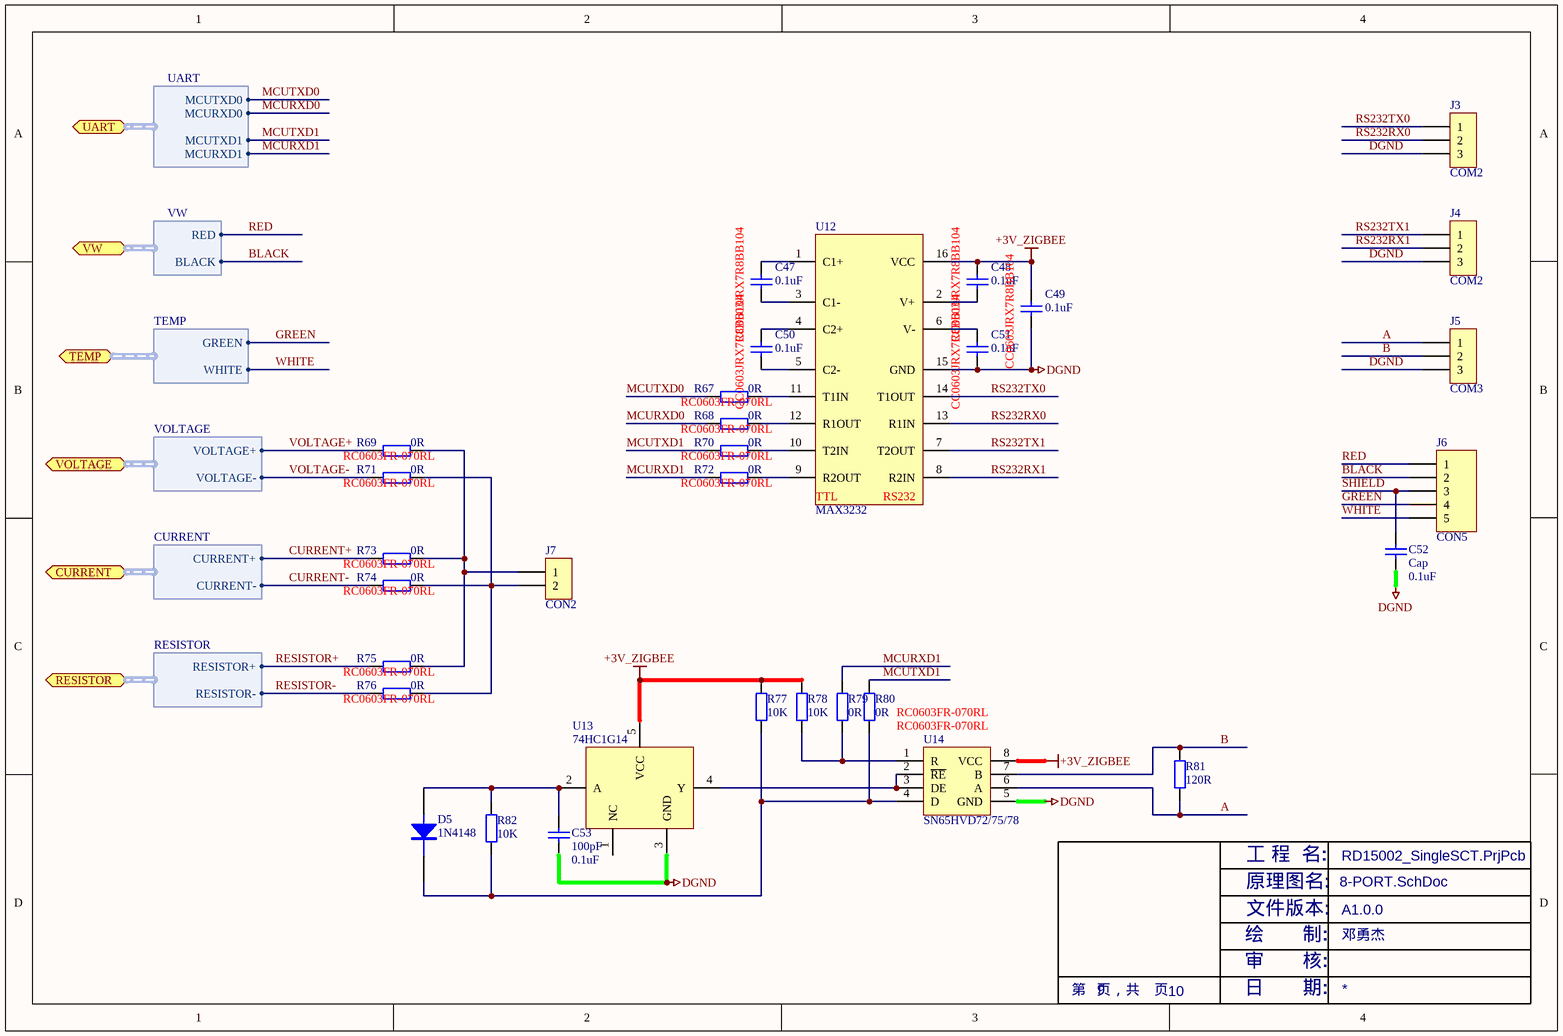
[diagram p8: 8-PORT.SchDoc]

### Parts
C47  0.1uF  Type No.: CC0603JRX7R8BB104  [CC0603]
C48  0.1uF  Type No.: CC0603JRX7R8BB104  [CC0603]
C49  0.1uF  Type No.: CC0603JRX7R8BB104  [CC0603]
C50  0.1uF  Type No.: CC0603JRX7R8BB104  [CC0603]
C51  0.1uF  Type No.: CC0603JRX7R8BB104  [CC0603]
C52  Cap  value 0.1uF  [CC0603]
C53  100pF  value 0.1uF  [CC0603]
D5  1N4148  [SOD323]
J3  COM2  [ECH350H-3P]
J4  COM2  [ECH350H-3P]
J5  COM3  [ECH350H-3P]
J6  CON5  [ECH350H-5P]
J7  CON2  [ECH350H-2P]
R67  0R  Type No.: RC0603FR-070RL  [CC0603]
R68  0R  Type No.: RC0603FR-070RL  [CC0603]
R69  0R  Type No.: RC0603FR-070RL  [CC0603]
R70  0R  Type No.: RC0603FR-070RL  [CC0603]
R71  0R  Type No.: RC0603FR-070RL  [CC0603]
R72  0R  Type No.: RC0603FR-070RL  [CC0603]
R73  0R  Type No.: RC0603FR-070RL  [CC0603]
R74  0R  Type No.: RC0603FR-070RL  [CC0603]
R75  0R  Type No.: RC0603FR-070RL  [CC0603]
R76  0R  Type No.: RC0603FR-070RL  [CC0603]
R77  10K  [CC0603]
R78  10K  [CC0603]
R79  0R  Type No.: RC0603FR-070RL  [CC0603]
R80  0R  Type No.: RC0603FR-070RL  [CC0603]
R81  120R  [CC0603]
R82  10K  [CC0603]
U12  MAX3232  [SO-16]
U13  74HC1G14  [SOT-23-5]
U14  SN65HVD72/75/78  [SO-8]

### Ports
CURRENT (harness CURRENT), RESISTOR (harness RESISTOR), TEMP (harness TEMP), UART (harness UART), VOLTAGE (harness VOLTAGE), VW (harness VW)

### Harnesses
UART: MCUTXD0, MCUTXD1, MCURXD0, MCURXD1
VW: RED, BLACK
TEMP: GREEN, WHITE
VOLTAGE: VOLTAGE+, VOLTAGE-
CURRENT: CURRENT+, CURRENT-
RESISTOR: RESISTOR+, RESISTOR-

### Nets
+3V_ZIGBEE: C48.2 C49.2 R77.2 R78.1 U12.16(VCC) U13.5(VCC) U14.8(VCC)
DGND: C49.1 C51.1 C52.1 C53.1 J3.3 J4.3 J5.3 U12.15(GND) U13.3(GND) U14.5(GND)
A: J5.1 R81.1 U14.6(A)
B: J5.2 R81.2 U14.7(B)
BLACK: J6.2 ; port VW.BLACK
CURRENT+: R73.2 ; port CURRENT.CURRENT+
CURRENT-: R74.2 ; port CURRENT.CURRENT-
GREEN: J6.4 ; port TEMP.GREEN
MCURXD0: R68.2 ; port UART.MCURXD0
MCURXD1: R72.2 R79.1 ; port UART.MCURXD1
MCUTXD0: R67.2 ; port UART.MCUTXD0
MCUTXD1: R70.2 R80.1 ; port UART.MCUTXD1
RED: J6.1 ; port VW.RED
RESISTOR+: R75.2 ; port RESISTOR.RESISTOR+
RESISTOR-: R76.2 ; port RESISTOR.RESISTOR-
RS232RX0: J3.2 U12.13(R1IN)
RS232RX1: J4.2 U12.8(R2IN)
RS232TX0: J3.1 U12.14(T1OUT)
RS232TX1: J4.1 U12.7(T2OUT)
SHIELD: C52.2 J6.3
VOLTAGE+: R69.2 ; port VOLTAGE.VOLTAGE+
VOLTAGE-: R71.2 ; port VOLTAGE.VOLTAGE-
WHITE: J6.5 ; port TEMP.WHITE
NetC47_1: C47.1 U12.3(C1-)
NetC47_2: C47.2 U12.1(C1+)
NetC48_1: C48.1 U12.2(V+)
NetC50_1: C50.1 U12.5(C2-)
NetC50_2: C50.2 U12.4(C2+)
NetC51_2: C51.2 U12.6(V-)
NetC53_2: C53.2 D5.1(A) R82.2 U13.2(A)
NetD5_2: D5.2(K) R77.1 R80.2 R82.1 U14.4(D)
NetJ7_1: J7.1 R69.1 R73.1 R75.1
NetJ7_2: J7.2 R71.1 R74.1 R76.1
NetR67_1: R67.1 U12.11(T1IN)
NetR68_1: R68.1 U12.12(R1OUT)
NetR70_1: R70.1 U12.10(T2IN)
NetR72_1: R72.1 U12.9(R2OUT)
NetR78_2: R78.2 R79.2 U14.1(R)
NetU13_4: U13.4(Y) U14.2(~{RE}) U14.3(DE)

Not connected (* = marked no-connect by the designer): U13 1(NC)

### Notes on the sheet
- 文件版本:
- 原理图名:
- 工 程  名:
- 绘       制:
- 审       核:
- 第   页，共    页
- 日       期:
- (in symbol MAX3232) TTL; RS232

### Library data of the parts
C47-C53 = Cap: Capacitor
  C52 C53: Published: 8-Jun-2000; LatestRevisionDate: 17-Jul-2002; LatestRevisionNote: Re-released for DXP Platform.; PackageReference: RAD-0.3; Publisher: Altium Limited; PackageDescription: Radial Cap, Thru-Hole; 2 Leads; 0.3 in Pin Spacing
D5 = DIODE
J3-J5 = SIP3: jointbar
J6 = Header 5: Header, 5-Pin; LatestRevisionDate: 17-Jul-2002; LatestRevisionNote: Re-released for DXP Platform.; Publisher: Altium Limited
J7 = SIP2: jointbar
R67-R76 R79 R80 = Res2: Resistor
R77 R78 R81 R82 = Res2: Resistor; Value: 1K; Published: 8-Jun-2000; LatestRevisionDate: 17-Jul-2002; LatestRevisionNote: Re-released for DXP Platform.; PackageReference: AXIAL-0.4; Publisher: Altium Limited
U12 = MAX3232: communication  IC

## Sheet 9-ZIGBEE.SchDoc: RD15002_SingleSCT.PrjPcb
size A4; DrawnBy: 邓勇杰; Revision: A1.0.0; SheetNumber: 10; SheetTotal: 10; Time: 2015/12/2
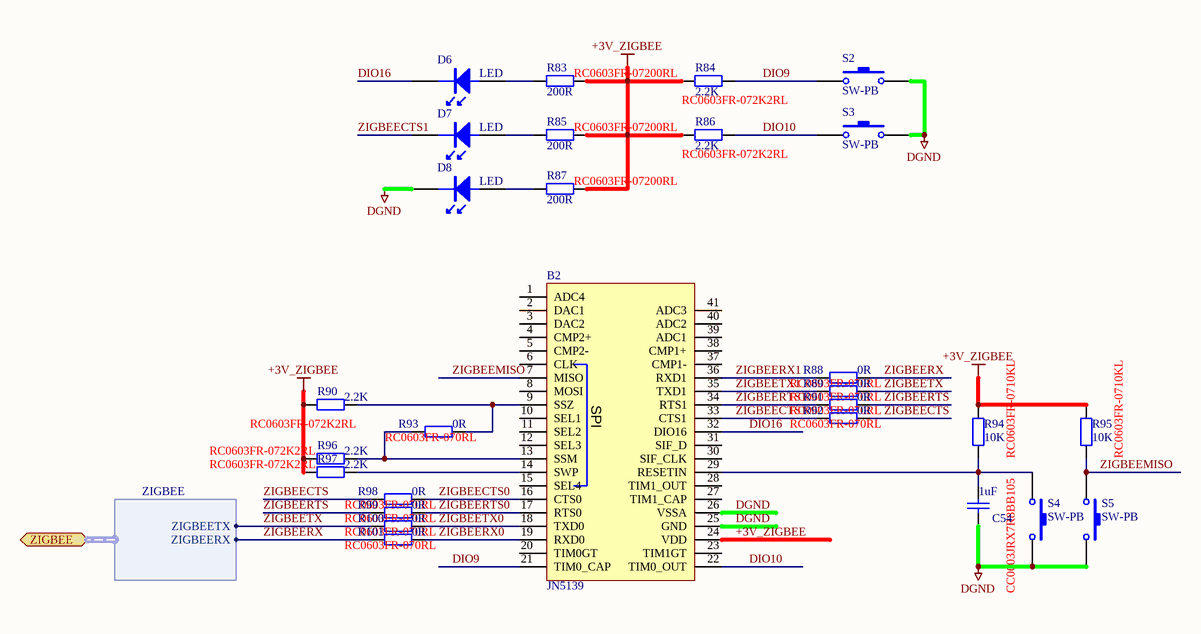
[diagram p9: 9-ZIGBEE.SchDoc]

### Parts
B2  JN5139  [JN5139]
C54  1uF  Type No.: CC0603JRX7R8BB105  [CC0603]
D6  LED  [D0603]
D7  LED  [D0603]
D8  LED  [D0603]
R83  200R  Type No.: RC0603FR-07200RL  [CC0603]
R84  2.2K  Type No.: RC0603FR-072K2RL  [CC0603]
R85  200R  Type No.: RC0603FR-07200RL  [CC0603]
R86  2.2K  Type No.: RC0603FR-072K2RL  [CC0603]
R87  200R  Type No.: RC0603FR-07200RL  [CC0603]
R88  0R  Type No.: RC0603FR-070RL  [CC0603]
R89  0R  Type No.: RC0603FR-070RL  [CC0603]
R90  2.2K  Type No.: RC0603FR-072K2RL  [CC0603]
R91  0R  Type No.: RC0603FR-070RL  [CC0603]
R92  0R  Type No.: RC0603FR-070RL  [CC0603]
R93  0R  Type No.: RC0603FR-070RL  [CC0603]
R94  10K  Type No.: RC0603FR-0710KL  [CC0603]
R95  10K  Type No.: RC0603FR-0710KL  [CC0603]
R96  2.2K  Type No.: RC0603FR-072K2RL  [CC0603]
R97  2.2K  Type No.: RC0603FR-072K2RL  [CC0603]
R98  0R  Type No.: RC0603FR-070RL  [CC0603]
R99  0R  Type No.: RC0603FR-070RL  [CC0603]
R100  0R  Type No.: RC0603FR-070RL  [CC0603]
R101  0R  Type No.: RC0603FR-070RL  [CC0603]
S2  SW-PB  [SPST]
S3  SW-PB  [SPST]
S4  SW-PB  [SPST]
S5  SW-PB  [SPST]

### Ports
ZIGBEE (harness ZIGBEE)

### Harnesses
ZIGBEE: ZIGBEETX, ZIGBEERX

### Nets
+3V_ZIGBEE: B2.24(VDD) R83.2 R84.1 R85.2 R86.1 R87.2 R90.1 R94.1 R95.1 R96.1 R97.1
DGND: B2.25(GND) B2.26(VSSA) C54.1 D8.2(K) S2.2 S3.2 S4.2 S5.2
DIO9: B2.21(TIM0_CAP) R84.2 S2.1
DIO10: B2.22(TIM0_OUT) R86.2 S3.1
DIO16: B2.32(DIO16) D6.2(K)
ZIGBEECTS: R92.1 R98.2
ZIGBEECTS0: B2.16(CTS0) R98.1
ZIGBEECTS1: B2.33(CTS1) D7.2(K) R92.2
ZIGBEEMISO: B2.7(MISO) R95.2 S5.1
ZIGBEERTS: R91.1 R99.2
ZIGBEERTS0: B2.17(RTS0) R99.1
ZIGBEERTS1: B2.34(RTS1) R91.2
ZIGBEERX: R88.1 R101.2 ; port ZIGBEE.ZIGBEERX
ZIGBEERX0: B2.19(RXD0) R101.1
ZIGBEERX1: B2.36(RXD1) R88.2
ZIGBEETX: R89.1 R100.2 ; port ZIGBEE.ZIGBEETX
ZIGBEETX0: B2.18(TXD0) R100.1
ZIGBEETX1: B2.35(TXD1) R89.2
NetB2_9: B2.9(SSZ) R90.2 R93.1
NetB2_13: B2.13(SSM) R93.2 R96.2
NetB2_14: B2.14(SWP) R97.2
NetB2_29: B2.29(RESETIN) C54.2 R94.2 S4.1
NetD6_1: D6.1(A) R83.1
NetD7_1: D7.1(A) R85.1
NetD8_1: D8.1(A) R87.1

Not connected (* = marked no-connect by the designer): B2 1(ADC4) 2(DAC1) 3(DAC2) 4(CMP2+) 5(CMP2-) 6(CLK) 8(MOSI) 10(SEL1) 11(SEL2) 12(SEL3) 15(SEL4) 20(TIM0GT) 23(TIM1GT) 27(TIM1_CAP) 28(TIM1_OUT) 30(SIF_CLK) 31(SIF_D) 37(CMP1-) 38(CMP1+) 39(ADC1) 40(ADC2) 41(ADC3)

### Notes on the sheet
- 文件版本:
- 原理图名:
- 工 程  名:
- 绘       制:
- 审       核:
- 第   页，共    页
- 日       期:
- (in symbol JN5139) SPI

### Library data of the parts
C54 = Cap: Capacitor
R83-R101 = Res2: Resistor
S2-S5 = SW-PB: Switch; Published: 24-Mar-1999; LatestRevisionDate: 17-Jul-2002; LatestRevisionNote: Re-released for DXP Platform.; PackageReference: SPST-2; Publisher: Altium Limited

## Nets that join several sheets
+3V_MCU: 1-POWER (BT1.1 C10.1 R5.1 R6.2), 2-MCU (6 pins)
+3V_ZIGBEE: 1-POWER (C14.1 C15.2 U3.5), 8-PORT (7 pins), 9-ZIGBEE (11 pins)
+5V: 1-POWER (11 pins), 2-MCU (R22.2), 3-VW_MODULE (15 pins)
+5V_ADC: 1-POWER (R10.1 R13.2 U4.6), 4-ADC (8 pins), 7-RES_CHECK (R62.2 R63.2)
BAT+: 1-POWER (7 pins), 3-VW_MODULE (C29.1 C30.2 U6.1 U6.8)
DGND: 1-POWER (32 pins), 2-MCU (14 pins), 3-VW_MODULE (12 pins), 4-ADC (9 pins), 7-RES_CHECK (R64.2 R65.1), 8-PORT (10 pins), 9-ZIGBEE (8 pins)
AD_BAT: 1-POWER (R4.2 R7.1), 2-MCU (U5.59)
AD_MCUVOL: 1-POWER (R6.1), 2-MCU (U5.60)
ADC_IN+: 4-ADC (R51.1), 5-VOL_CHECK (R102.1), 6-CURRENT_CHECK (R104.1), 7-RES_CHECK (R106.1)
ADC_IN-: 4-ADC (R53.1), 5-VOL_CHECK (R103.1), 6-CURRENT_CHECK (R105.1), 7-RES_CHECK (R107.1)
BLACK: 3-VW_MODULE (RE1.3), 8-PORT (J6.2)
CURRENT+: 6-CURRENT_CHECK (R61.1 R104.2), 8-PORT (R73.2)
CURRENT-: 6-CURRENT_CHECK (R61.2 R105.2), 8-PORT (R74.2)
DRIVER_EN: 2-MCU (U5.2), 3-VW_MODULE (R27.1 U6.3)
GREEN: 4-ADC (R46.2 R48.2 R49.1), 8-PORT (J6.4)
MCURXD0: 2-MCU (U5.33), 8-PORT (R68.2)
MCURXD1: 2-MCU (R20.1 U5.35), 8-PORT (R72.2 R79.1)
MCUTXD0: 2-MCU (U5.32), 8-PORT (R67.2)
MCUTXD1: 2-MCU (R21.1 U5.34), 8-PORT (R70.2 R80.1)
PWR_ADC: 1-POWER (R14.2), 2-MCU (U5.23)
PWR_MAIN: 1-POWER (R2.1 U1.1), 2-MCU (U5.20)
PWR_MCU: 1-POWER (R8.1 U2.3), 2-MCU (U5.21)
PWR_ZIGBEE: 1-POWER (R9.1 U3.3), 2-MCU (U5.22)
RED: 3-VW_MODULE (RE1.6), 8-PORT (J6.1)
RESISTOR+: 7-RES_CHECK (R63.1), 8-PORT (R75.2)
RESISTOR-: 7-RES_CHECK (R65.2 R66.1), 8-PORT (R76.2)
SPI1_CS1: 2-MCU (R19.2), 4-ADC (U10.7)
SPI1_MISO: 2-MCU (R18.2), 4-ADC (U10.8)
SPI1_SCK: 2-MCU (R17.2), 4-ADC (U10.9)
VOLTAGE+: 5-VOL_CHECK (R58.1), 8-PORT (R69.2)
VOLTAGE-: 5-VOL_CHECK (R60.2), 8-PORT (R71.2)
VW_DRIVE: 2-MCU (U5.37), 3-VW_MODULE (U6.2)
VW_RE: 2-MCU (U5.13), 3-VW_MODULE (R40.2 U7.1)
VW_TRCN: 2-MCU (U5.14), 3-VW_MODULE (R25.2)
WHITE: 4-ADC (R56.2 U10.3), 8-PORT (J6.5)
ZIGBEERX: 2-MCU (R21.2), 9-ZIGBEE (R88.1 R101.2)
ZIGBEETX: 2-MCU (R20.2), 9-ZIGBEE (R89.1 R100.2)